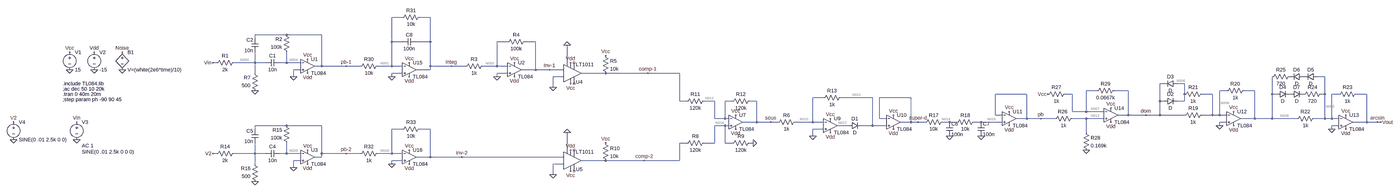
[diagram p0: schematic circuit_complet(2).asc, whole sheet]
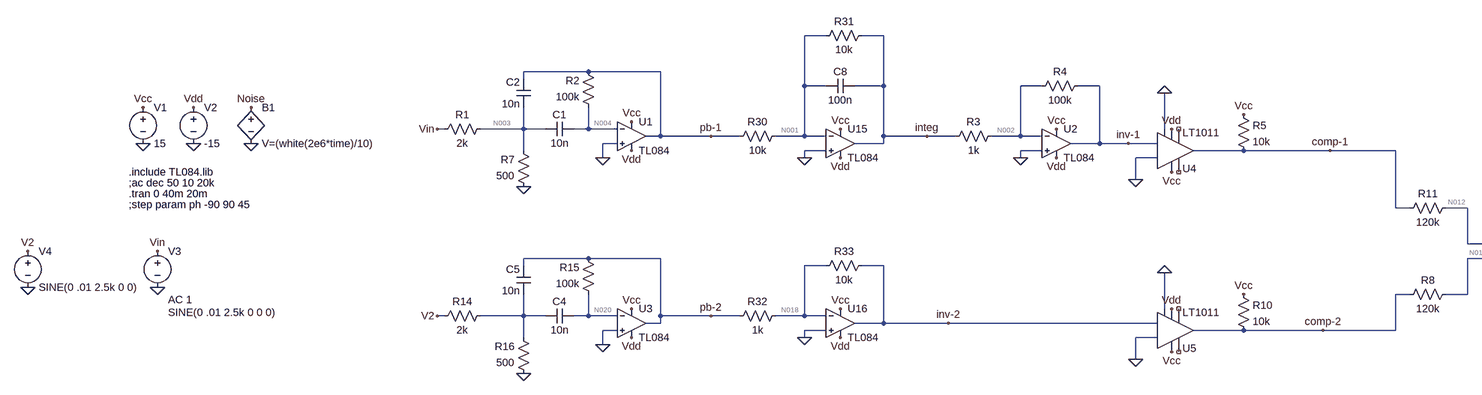
[diagram p1: schematic circuit_complet(2).asc, part, row 1 of 1, column 1 of 2]
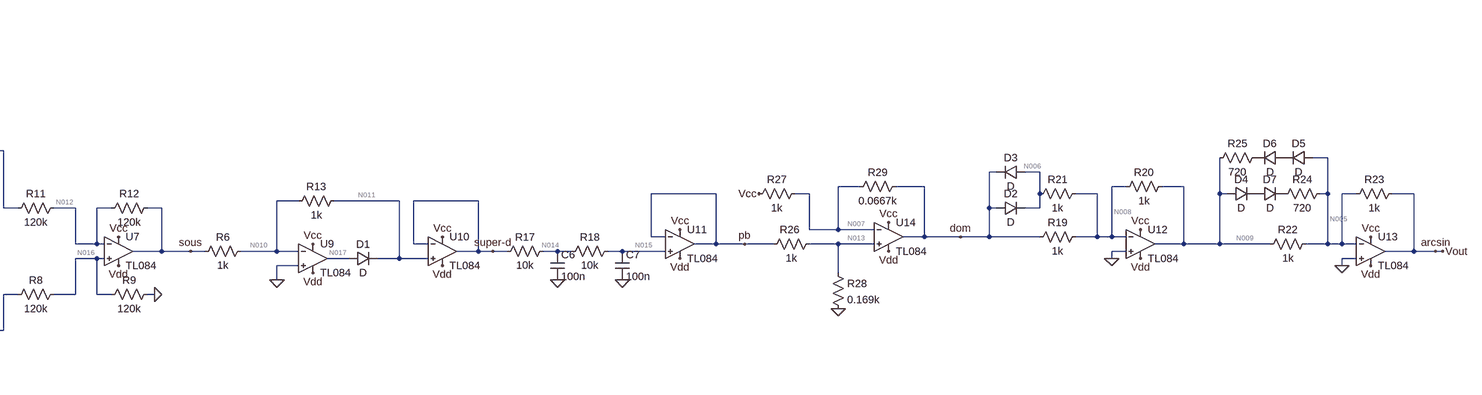
[diagram p2: schematic circuit_complet(2).asc, part, row 1 of 1, column 2 of 2]
circuit_complet(2).asc, the LTspice schematic file:
Version 4
SHEET 1 5272 756
WIRE 272 -48 224 -48
WIRE 400 -48 352 -48
WIRE -256 32 -400 32
WIRE -96 32 -256 32
WIRE -400 48 -400 32
WIRE 224 64 224 -48
WIRE 272 64 224 64
WIRE 400 64 400 -48
WIRE 400 64 336 64
WIRE 752 64 704 64
WIRE 880 64 832 64
WIRE -576 160 -592 160
WIRE -400 160 -400 112
WIRE -400 160 -496 160
WIRE -352 160 -400 160
WIRE -256 160 -256 112
WIRE -256 160 -288 160
WIRE -192 160 -256 160
WIRE 1024 160 1024 80
WIRE -96 176 -96 32
WIRE -96 176 -128 176
WIRE 16 176 -96 176
WIRE 80 176 16 176
WIRE 224 176 224 64
WIRE 224 176 160 176
WIRE 272 176 224 176
WIRE 400 176 400 64
WIRE 496 176 400 176
WIRE 560 176 496 176
WIRE 704 176 704 64
WIRE 704 176 640 176
WIRE 752 176 704 176
WIRE -192 192 -224 192
WIRE 400 192 400 176
WIRE 400 192 336 192
WIRE 880 192 880 64
WIRE 880 192 816 192
WIRE 944 192 880 192
WIRE 1008 192 944 192
WIRE -400 208 -400 160
WIRE 272 208 224 208
WIRE 752 208 704 208
WIRE 1200 208 1088 208
WIRE 1392 208 1200 208
WIRE 1664 208 1392 208
WIRE -224 224 -224 192
WIRE 224 224 224 208
WIRE 704 224 704 208
WIRE 1008 224 960 224
WIRE 4608 224 4576 224
WIRE 3872 256 3856 256
WIRE 3968 256 3936 256
WIRE 960 272 960 224
WIRE 3568 288 3520 288
WIRE 3712 288 3648 288
WIRE 4160 288 4128 288
WIRE 4288 288 4240 288
WIRE 3248 304 3104 304
WIRE 3456 304 3424 304
WIRE 3968 304 3968 256
WIRE 4096 304 4048 304
WIRE 4368 304 4368 224
WIRE 4384 304 4368 304
WIRE 4608 304 4608 224
WIRE 4608 304 4592 304
WIRE 4672 304 4640 304
WIRE 4800 304 4752 304
WIRE 2320 320 2272 320
WIRE 2544 320 2400 320
WIRE 2720 320 2576 320
WIRE 1664 336 1664 208
WIRE 1696 336 1664 336
WIRE 1824 336 1776 336
WIRE 1904 336 1872 336
WIRE 2016 336 1984 336
WIRE 3856 336 3856 256
WIRE 3872 336 3856 336
WIRE 3968 336 3968 304
WIRE 3968 336 3936 336
WIRE 3456 384 3456 304
WIRE 3520 384 3520 288
WIRE 3520 384 3456 384
WIRE 3600 384 3520 384
WIRE 3104 400 3104 304
WIRE 3136 400 3104 400
WIRE 3712 400 3712 288
WIRE 3712 400 3664 400
WIRE 3792 400 3712 400
WIRE 3856 400 3856 336
WIRE 3856 400 3792 400
WIRE 3968 400 3856 400
WIRE 4096 400 4096 304
WIRE 4096 400 4048 400
WIRE 4128 400 4128 288
WIRE 4128 400 4096 400
WIRE 4160 400 4128 400
WIRE 1824 416 1824 336
WIRE 1872 416 1872 336
WIRE 1872 416 1824 416
WIRE 1888 416 1872 416
WIRE 2576 416 2576 320
WIRE 2608 416 2576 416
WIRE 3248 416 3248 304
WIRE 3248 416 3200 416
WIRE 3312 416 3248 416
WIRE 3376 416 3312 416
WIRE 3520 416 3456 416
WIRE 3600 416 3520 416
WIRE 4288 416 4288 288
WIRE 4288 416 4224 416
WIRE 4368 416 4368 304
WIRE 4368 416 4288 416
WIRE 4480 416 4368 416
WIRE 4608 416 4608 304
WIRE 4608 416 4560 416
WIRE 4640 416 4640 304
WIRE 4640 416 4608 416
WIRE 4672 416 4640 416
WIRE 2016 432 2016 336
WIRE 2016 432 1952 432
WIRE 2080 432 2016 432
WIRE 2112 432 2080 432
WIRE 2272 432 2272 320
WIRE 2272 432 2192 432
WIRE 2320 432 2272 432
WIRE 2720 432 2720 320
WIRE 2720 432 2672 432
WIRE 2752 432 2720 432
WIRE 2784 432 2752 432
WIRE 2896 432 2864 432
WIRE 2928 432 2896 432
WIRE 3040 432 3008 432
WIRE 3136 432 3040 432
WIRE 4160 432 4128 432
WIRE 4800 432 4800 304
WIRE 4800 432 4736 432
WIRE 4848 432 4800 432
WIRE 4864 432 4848 432
WIRE -256 448 -400 448
WIRE -96 448 -256 448
WIRE 1872 448 1824 448
WIRE 1888 448 1872 448
WIRE 2432 448 2384 448
WIRE 2544 448 2544 320
WIRE 2544 448 2496 448
WIRE 2608 448 2544 448
WIRE 4128 448 4128 432
WIRE 4672 448 4640 448
WIRE -400 464 -400 448
WIRE 272 464 224 464
WIRE 400 464 352 464
WIRE 2320 464 2272 464
WIRE 4640 464 4640 448
WIRE 3520 480 3520 416
WIRE 2272 496 2272 464
WIRE 1696 528 1664 528
WIRE 1824 528 1824 448
WIRE 1824 528 1776 528
WIRE 1872 528 1872 448
WIRE 1904 528 1872 528
WIRE 2000 528 1984 528
WIRE 1024 560 1024 480
WIRE -576 576 -592 576
WIRE -400 576 -400 528
WIRE -400 576 -496 576
WIRE -352 576 -400 576
WIRE -256 576 -256 528
WIRE -256 576 -288 576
WIRE -192 576 -256 576
WIRE -96 576 -96 448
WIRE 16 576 -96 576
WIRE 80 576 16 576
WIRE 224 576 224 464
WIRE 224 576 160 576
WIRE 272 576 224 576
WIRE -96 592 -96 576
WIRE -96 592 -128 592
WIRE 400 592 400 464
WIRE 400 592 336 592
WIRE 544 592 400 592
WIRE 1008 592 544 592
WIRE -192 608 -224 608
WIRE 272 608 224 608
WIRE 1200 608 1088 608
WIRE 1376 608 1200 608
WIRE 1664 608 1664 528
WIRE 1664 608 1376 608
WIRE -400 624 -400 576
WIRE 224 624 224 608
WIRE 1008 624 960 624
WIRE -224 640 -224 608
WIRE 960 672 960 624
FLAG -1392 512 0
FLAG -1424 192 0
FLAG -1312 192 0
FLAG -1312 112 Vdd
FLAG -1424 112 Vcc
FLAG -592 160 Vin
FLAG -1392 432 Vin
FLAG -1184 192 0
FLAG -1184 112 Noise
FLAG 784 160 Vcc
FLAG 784 224 Vdd
FLAG 704 224 0
FLAG 960 272 0
FLAG 1024 80 0
FLAG 1040 256 Vcc
FLAG 1040 160 Vdd
FLAG 1200 128 Vcc
FLAG 960 672 0
FLAG 1024 480 0
FLAG 1040 656 Vcc
FLAG 1040 560 Vdd
FLAG 1200 528 Vcc
FLAG 1920 400 Vcc
FLAG 1920 464 Vdd
FLAG 2000 528 0
FLAG -1680 512 0
FLAG -1680 432 V2
FLAG -224 224 0
FLAG -160 144 Vcc
FLAG -160 208 Vdd
FLAG -400 288 0
FLAG -592 576 V2
FLAG 2352 416 Vcc
FLAG 2352 480 Vdd
FLAG 2272 496 0
FLAG 2640 400 Vcc
FLAG 2640 464 Vdd
FLAG 2896 496 0
FLAG 3040 496 0
FLAG 3168 384 Vcc
FLAG 3168 448 Vdd
FLAG 4128 448 0
FLAG 4192 384 Vcc
FLAG 4192 448 Vdd
FLAG 4640 464 0
FLAG 4704 400 Vcc
FLAG 4704 464 Vdd
FLAG 4864 432 Vout
FLAG 3520 560 0
FLAG 3632 368 Vcc
FLAG 3632 432 Vdd
FLAG 3344 304 Vcc
FLAG -224 640 0
FLAG -160 560 Vcc
FLAG -160 624 Vdd
FLAG -400 704 0
FLAG 304 160 Vcc
FLAG 304 224 Vdd
FLAG 224 224 0
FLAG 304 560 Vcc
FLAG 304 624 Vdd
FLAG 224 624 0
FLAG 16 176 pb-1
FLAG 16 576 pb-2
FLAG 496 176 integ
FLAG 944 192 inv-1
FLAG 544 592 inv-2
FLAG 1392 208 comp-1
FLAG 1376 608 comp-2
FLAG 2080 432 sous
FLAG 2752 432 super-d
FLAG 3312 416 pb
FLAG 3792 400 dom
FLAG 4848 432 arcsin
SYMBOL res -480 144 R90
WINDOW 0 0 56 VBottom 2
WINDOW 3 32 56 VTop 2
SYMATTR InstName R1
SYMATTR Value 2k
SYMBOL voltage -1424 96 R0
WINDOW 123 0 0 Left 0
WINDOW 39 0 0 Left 0
SYMATTR InstName V1
SYMATTR Value 15
SYMBOL voltage -1312 96 R0
WINDOW 123 0 0 Left 0
WINDOW 39 0 0 Left 0
SYMATTR InstName V2
SYMATTR Value -15
SYMBOL voltage -1392 416 R0
WINDOW 123 24 124 Left 2
WINDOW 39 0 0 Left 0
WINDOW 3 24 152 Left 2
SYMATTR Value2 AC 1
SYMATTR Value SINE(0 .01 2.5k 0 0 0)
SYMATTR InstName V3
SYMBOL bv -1184 96 R0
SYMATTR InstName B1
SYMATTR Value V=(white(2e6*time)/10)
SYMBOL res 656 160 R90
WINDOW 0 0 56 VBottom 2
WINDOW 3 32 56 VTop 2
SYMATTR InstName R3
SYMATTR Value 1k
SYMBOL res 848 48 R90
WINDOW 0 0 56 VBottom 2
WINDOW 3 32 56 VTop 2
SYMATTR InstName R4
SYMATTR Value 100k
SYMBOL Opamps\\opamp2 784 128 R0
SYMATTR InstName U2
SYMATTR Value TL084
SYMBOL Comparators\\LT1011 1040 208 M180
SYMATTR InstName U4
SYMBOL res 1184 112 R0
SYMATTR InstName R5
SYMATTR Value 10k
SYMBOL res 1184 512 R0
SYMATTR InstName R10
SYMATTR Value 10k
SYMBOL res 1792 320 R90
WINDOW 0 0 56 VBottom 2
WINDOW 3 32 56 VTop 2
SYMATTR InstName R11
SYMATTR Value 120k
SYMBOL Opamps\\opamp2 1920 368 R0
SYMATTR InstName U7
SYMATTR Value TL084
SYMBOL res 2000 320 R90
WINDOW 0 0 56 VBottom 2
WINDOW 3 32 56 VTop 2
SYMATTR InstName R12
SYMATTR Value 120k
SYMBOL res 1792 512 R90
WINDOW 0 0 56 VBottom 2
WINDOW 3 32 56 VTop 2
SYMATTR InstName R8
SYMATTR Value 120k
SYMBOL res 2000 512 R90
WINDOW 0 0 56 VBottom 2
WINDOW 3 32 56 VTop 2
SYMATTR InstName R9
SYMATTR Value 120k
SYMBOL voltage -1680 416 R0
WINDOW 123 0 0 Left 0
WINDOW 39 0 0 Left 0
SYMATTR InstName V4
SYMATTR Value SINE(0 .01 2.5k 0 0)
SYMBOL Comparators\\LT1011 1040 608 M180
SYMATTR InstName U5
SYMBOL res -240 128 R180
WINDOW 0 36 76 Left 2
WINDOW 3 36 40 Left 2
SYMATTR InstName R2
SYMATTR Value 100k
SYMBOL res -384 304 R180
WINDOW 0 36 76 Left 2
WINDOW 3 36 40 Left 2
SYMATTR InstName R7
SYMATTR Value 500
SYMBOL cap -288 144 R90
WINDOW 0 0 32 VBottom 2
WINDOW 3 32 32 VTop 2
SYMATTR InstName C1
SYMATTR Value 10n
SYMBOL cap -384 112 R180
WINDOW 0 24 56 Left 2
WINDOW 3 24 8 Left 2
SYMATTR InstName C2
SYMATTR Value 10n
SYMBOL Opamps\\opamp2 -160 112 R0
SYMATTR InstName U1
SYMATTR Value TL084
SYMBOL res 2208 416 R90
WINDOW 0 0 56 VBottom 2
WINDOW 3 32 56 VTop 2
SYMATTR InstName R6
SYMATTR Value 1k
SYMBOL res 2416 304 R90
WINDOW 0 0 56 VBottom 2
WINDOW 3 32 56 VTop 2
SYMATTR InstName R13
SYMATTR Value 1k
SYMBOL Opamps\\opamp2 2352 384 R0
SYMATTR InstName U9
SYMATTR Value TL084
SYMBOL diode 2432 464 R270
WINDOW 0 32 32 VTop 2
WINDOW 3 0 32 VBottom 2
SYMATTR InstName D1
SYMBOL Opamps\\opamp2 2640 368 R0
SYMATTR InstName U10
SYMATTR Value TL084
SYMBOL res 2880 416 R90
WINDOW 0 0 56 VBottom 2
WINDOW 3 32 56 VTop 2
SYMATTR InstName R17
SYMATTR Value 10k
SYMBOL res 3024 416 R90
WINDOW 0 0 56 VBottom 2
WINDOW 3 32 56 VTop 2
SYMATTR InstName R18
SYMATTR Value 10k
SYMBOL cap 2880 432 R0
SYMATTR InstName C6
SYMATTR Value 100n
SYMATTR SpiceLine V=4 Irms=0 Rser=0 Lser=0
SYMBOL cap 3024 432 R0
SYMATTR InstName C7
SYMATTR Value 100n
SYMBOL Opamps\\opamp2 3168 352 R0
SYMATTR InstName U11
SYMATTR Value TL084
SYMBOL res 4064 384 R90
WINDOW 0 0 56 VBottom 2
WINDOW 3 32 56 VTop 2
SYMATTR InstName R19
SYMATTR Value 1k
SYMBOL res 4256 272 R90
WINDOW 0 0 56 VBottom 2
WINDOW 3 32 56 VTop 2
SYMATTR InstName R20
SYMATTR Value 1k
SYMBOL res 4064 288 R90
WINDOW 0 0 56 VBottom 2
WINDOW 3 32 56 VTop 2
SYMATTR InstName R21
SYMATTR Value 1k
SYMBOL Opamps\\opamp2 4192 352 R0
SYMATTR InstName U12
SYMATTR Value TL084
SYMBOL diode 3872 352 R270
WINDOW 0 32 32 VTop 2
WINDOW 3 0 32 VBottom 2
SYMATTR InstName D2
SYMBOL diode 3936 240 R90
WINDOW 0 0 32 VBottom 2
WINDOW 3 32 32 VTop 2
SYMATTR InstName D3
SYMBOL res 4576 400 R90
WINDOW 0 0 56 VBottom 2
WINDOW 3 32 56 VTop 2
SYMATTR InstName R22
SYMATTR Value 1k
SYMBOL res 4768 288 R90
WINDOW 0 0 56 VBottom 2
WINDOW 3 32 56 VTop 2
SYMATTR InstName R23
SYMATTR Value 1k
SYMBOL Opamps\\opamp2 4704 368 R0
SYMATTR InstName U13
SYMATTR Value TL084
SYMBOL diode 4384 320 R270
WINDOW 0 32 32 VTop 2
WINDOW 3 0 32 VBottom 2
SYMATTR InstName D4
SYMBOL diode 4576 208 R90
WINDOW 0 0 32 VBottom 2
WINDOW 3 32 32 VTop 2
SYMATTR InstName D5
SYMBOL diode 4512 208 R90
WINDOW 0 0 32 VBottom 2
WINDOW 3 32 32 VTop 2
SYMATTR InstName D6
SYMBOL diode 4448 320 R270
WINDOW 0 32 32 VTop 2
WINDOW 3 0 32 VBottom 2
SYMATTR InstName D7
SYMBOL res 4608 288 R90
WINDOW 0 0 56 VBottom 2
WINDOW 3 32 56 VTop 2
SYMATTR InstName R24
SYMATTR Value 720
SYMBOL res 4464 208 R90
WINDOW 0 0 56 VBottom 2
WINDOW 3 32 56 VTop 2
SYMATTR InstName R25
SYMATTR Value 720
SYMBOL res 3472 400 R90
WINDOW 0 0 60 VBottom 2
WINDOW 3 32 56 VTop 2
SYMATTR InstName R26
SYMATTR Value 1k
SYMBOL res 3504 464 R0
SYMATTR InstName R28
SYMATTR Value 0.169k
SYMBOL res 3664 272 R90
WINDOW 0 0 56 VBottom 2
WINDOW 3 32 56 VTop 2
SYMATTR InstName R29
SYMATTR Value 0.0667k
SYMBOL res 3440 288 R90
WINDOW 0 0 56 VBottom 2
WINDOW 3 32 56 VTop 2
SYMATTR InstName R27
SYMATTR Value 1k
SYMBOL Opamps\\opamp2 3632 336 R0
SYMATTR InstName U14
SYMATTR Value TL084
SYMBOL res -480 560 R90
WINDOW 0 0 56 VBottom 2
WINDOW 3 32 56 VTop 2
SYMATTR InstName R14
SYMATTR Value 2k
SYMBOL res -240 544 R180
WINDOW 0 36 76 Left 2
WINDOW 3 36 40 Left 2
SYMATTR InstName R15
SYMATTR Value 100k
SYMBOL res -384 720 R180
WINDOW 0 36 76 Left 2
WINDOW 3 36 40 Left 2
SYMATTR InstName R16
SYMATTR Value 500
SYMBOL cap -288 560 R90
WINDOW 0 0 32 VBottom 2
WINDOW 3 32 32 VTop 2
SYMATTR InstName C4
SYMATTR Value 10n
SYMBOL cap -384 528 R180
WINDOW 0 24 56 Left 2
WINDOW 3 24 8 Left 2
SYMATTR InstName C5
SYMATTR Value 10n
SYMBOL Opamps\\opamp2 -160 528 R0
SYMATTR InstName U3
SYMATTR Value TL084
SYMBOL res 176 160 R90
WINDOW 0 0 56 VBottom 2
WINDOW 3 32 56 VTop 2
SYMATTR InstName R30
SYMATTR Value 10k
SYMBOL res 368 -64 R90
WINDOW 0 0 56 VBottom 2
WINDOW 3 32 56 VTop 2
SYMATTR InstName R31
SYMATTR Value 10k
SYMBOL cap 336 48 R90
WINDOW 0 0 32 VBottom 2
WINDOW 3 32 32 VTop 2
SYMATTR InstName C8
SYMATTR Value 100n
SYMBOL Opamps\\opamp2 304 128 R0
SYMATTR InstName U15
SYMATTR Value TL084
SYMBOL res 176 560 R90
WINDOW 0 0 56 VBottom 2
WINDOW 3 32 56 VTop 2
SYMATTR InstName R32
SYMATTR Value 1k
SYMBOL res 368 448 R90
WINDOW 0 0 56 VBottom 2
WINDOW 3 32 56 VTop 2
SYMATTR InstName R33
SYMATTR Value 10k
SYMBOL Opamps\\opamp2 304 528 R0
SYMATTR InstName U16
SYMATTR Value TL084
TEXT -1456 280 Left 2 !;ac dec 50 10 20k
TEXT -1456 304 Left 2 !.tran 0 40m 20m
TEXT -1456 256 Left 2 !.include TL084.lib
TEXT -1456 328 Left 2 !;step param ph -90 90 45

The netlist it stands for:
* circuit_complet(2).asc
R1 N003 Vin 2k
V1 Vcc 0 15
V2 Vdd 0 -15
V3 Vin 0 SINE(0 .01 2.5k 0 0 0) AC 1
B1 Noise 0 V=(white(2e6*time)/10)
R3 N002 integ 1k
R4 inv-1 N002 100k
XU2 0 N002 Vcc Vdd inv-1 TL084  ; pins In+ In- V+ V- OUT
XU4 0 inv-1 0 Vdd NC_01 NC_02 comp-1 Vcc LT1011
R5 Vcc comp-1 10k
R10 Vcc comp-2 10k
R11 N012 comp-1 120k
XU7 N016 N012 Vcc Vdd sous TL084  ; pins In+ In- V+ V- OUT
R12 sous N012 120k
R8 N016 comp-2 120k
R9 0 N016 120k
V4 V2 0 SINE(0 .01 2.5k 0 0)
XU5 0 inv-2 0 Vdd NC_03 NC_04 comp-2 Vcc LT1011
R2 N004 pb-1 100k
R7 0 N003 500
C1 N004 N003 10n
C2 N003 pb-1 10n
XU1 0 N004 Vcc Vdd pb-1 TL084  ; pins In+ In- V+ V- OUT
R6 N010 sous 1k
R13 N011 N010 1k
XU9 0 N010 Vcc Vdd N017 TL084  ; pins In+ In- V+ V- OUT
D1 N017 N011 D
XU10 N011 super-d Vcc Vdd super-d TL084  ; pins In+ In- V+ V- OUT
R17 N014 super-d 10k
R18 N015 N014 10k
C6 N014 0 100n V=4 Irms=0 Rser=0 Lser=0
C7 N015 0 100n
XU11 N015 pb Vcc Vdd pb TL084  ; pins In+ In- V+ V- OUT
R19 N008 dom 1k
R20 N009 N008 1k
R21 N008 N006 1k
XU12 0 N008 Vcc Vdd N009 TL084  ; pins In+ In- V+ V- OUT
D2 dom N006 D
D3 N006 dom D
R22 N005 N009 1k
R23 arcsin N005 1k
XU13 0 N005 Vcc Vdd arcsin TL084  ; pins In+ In- V+ V- OUT
D4 N009 P001 D
D5 N005 P002 D
D6 P002 P003 D
D7 P001 P004 D
R24 N005 P004 720
R25 P003 N009 720
R26 N013 pb 1k
R28 N013 0 0.169k
R29 dom N007 0.0667k
R27 N007 Vcc 1k
XU14 N013 N007 Vcc Vdd dom TL084  ; pins In+ In- V+ V- OUT
R14 N019 V2 2k
R15 N020 pb-2 100k
R16 0 N019 500
C4 N020 N019 10n
C5 N019 pb-2 10n
XU3 0 N020 Vcc Vdd pb-2 TL084  ; pins In+ In- V+ V- OUT
R30 N001 pb-1 10k
R31 integ N001 10k
C8 integ N001 100n
XU15 0 N001 Vcc Vdd integ TL084  ; pins In+ In- V+ V- OUT
R32 N018 pb-2 1k
R33 inv-2 N018 10k
XU16 0 N018 Vcc Vdd inv-2 TL084  ; pins In+ In- V+ V- OUT
.model D D
.lib standard.dio
;ac dec 50 10 20k
.tran 0 40m 20m
.include TL084.lib
;step param ph -90 90 45
.lib LTC1.lib
.backanno
.end

* Results of the author's LTspice run, read from the files saved beside the schematic
* Operating Point, zero values left out:
*   V(n003) = -2 mV
*   V(vin) = -10 mV
*   V(vcc) = 15 V
*   V(vdd) = -15 V
*   V(n002) = 10.97 µV
*   V(integ) = 6.916 µV
*   V(inv-1) = 420.8 µV
*   V(comp-1) = 13.86 V
*   V(comp-2) = 166.3 mV
*   V(n012) = 212.8 mV
*   V(sous) = -13.44 V
*   V(n016) = 83.15 mV
*   V(inv-2) = -33.63 µV
*   V(n004) = 10.97 µV
*   V(pb-1) = 15.48 µV
*   V(n010) = -348.5 mV
*   V(n011) = 12.74 V
*   V(n017) = 13.46 V
*   V(super-d) = 12.74 V
*   V(n014) = 12.74 V
*   V(n015) = 12.74 V
*   V(pb) = 12.74 V
*   V(n008) = 20.23 µV
*   V(dom) = 964 mV
*   V(n009) = -1.301 V
*   V(n006) = 337 mV
*   V(n005) = 2.843 µV
*   V(arcsin) = 1.433 V
*   V(p001) = -650.4 mV
*   V(p002) = -602.8 mV
*   V(p003) = -1.206 V
*   V(p004) = 2.843 µV
*   V(n013) = 1.842 V
*   V(n007) = 1.842 V
*   V(n020) = 10.97 µV
*   V(pb-2) = 15.48 µV
*   V(n001) = 10.97 µV
*   V(n018) = 10.97 µV
*   I(D6) = 132.3 µA
*   I(D5) = 132.3 µA
*   I(D2) = 337 µA
*   I(D1) = 13.09 mA
*   I(R33) = -4.46 nA
*   I(R32) = -4.505 nA
*   I(R31) = -405.5 pA
*   I(R30) = -450.5 pA
*   I(R15) = -45.05 pA
*   I(R27) = -13.16 mA
*   I(R29) = -13.16 mA
*   I(R28) = 10.9 mA
*   I(R26) = -10.9 mA
*   I(R25) = 132.3 µA
*   I(R23) = 1.433 mA
*   I(R22) = 1.301 mA
*   I(R21) = -337 µA
*   I(R20) = -1.301 mA
*   I(R19) = -963.9 µA
*   I(R18) = -57.83 pA
*   I(R17) = -57.83 pA
*   I(R13) = 13.09 mA
*   I(R6) = 13.09 mA
*   I(R7) = 4 µA
*   I(R2) = -45.05 pA
*   I(R9) = -692.9 nA
*   I(R8) = -693 nA
*   I(R12) = -113.7 µA
*   I(R11) = -113.7 µA
*   I(R10) = 1.483 mA
*   I(R5) = 113.8 µA
*   I(R4) = 4.098 nA
*   I(R3) = 4.053 nA
*   I(R1) = 4 µA
*   I(V3) = 4 µA
*   I(V2) = 173.7 mA
*   I(V1) = -190 mA